# EAGLE design CDTV-adaptor-ATX_1.1 (EAGLE 7.7.0)
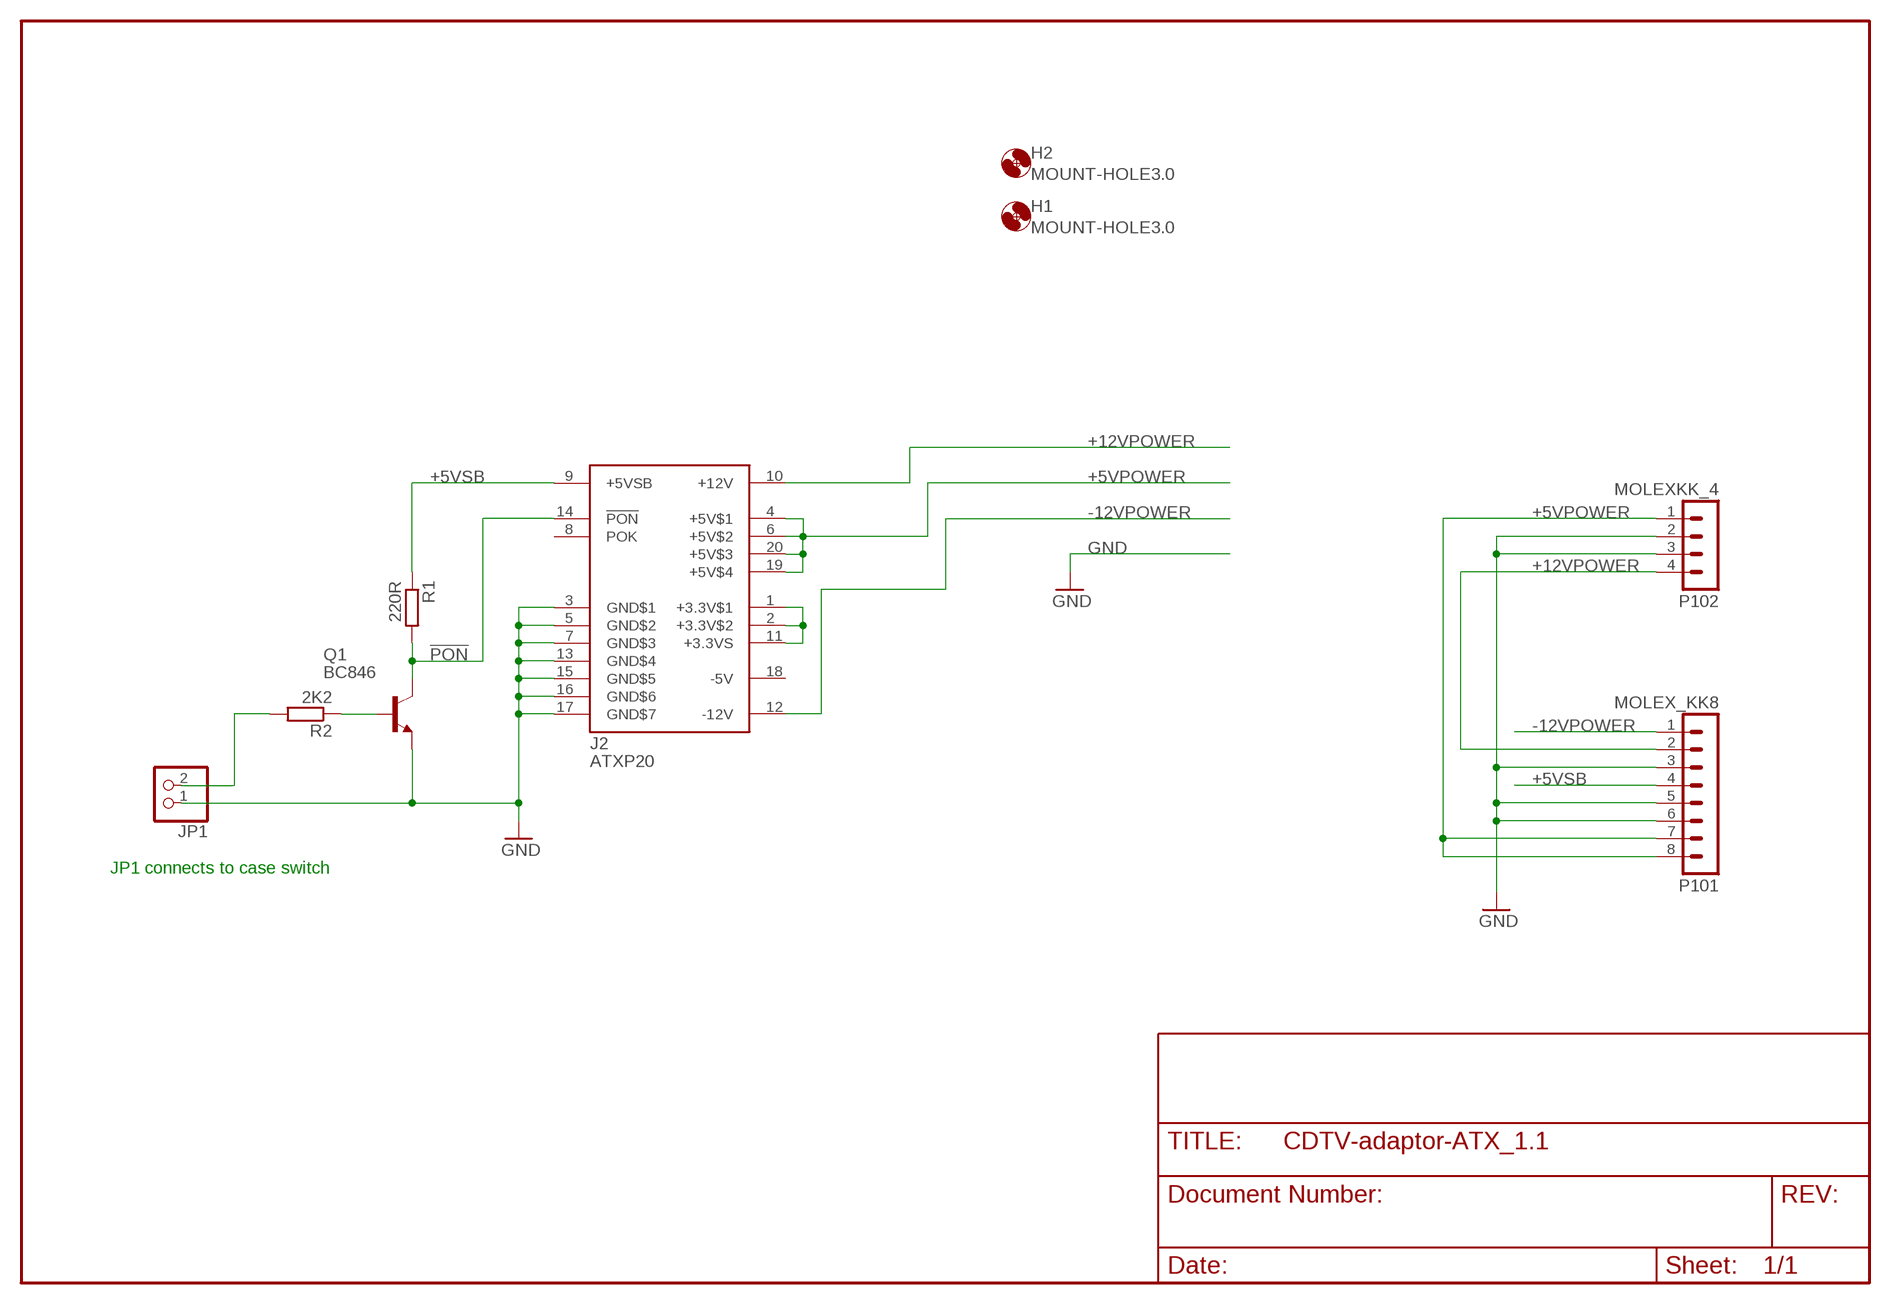
[diagram p0: schematic, sheet 1]

## Parts
H1  MOUNT-HOLE3.0  [3,0]
H2  MOUNT-HOLE3.0  [3,0]
J2  ATXP20  [MOLEX39281203]
JP1  PINHD-1X2  [1X02]
P101  MOLEX_KK8  [MOLEX_KK8]
P102  MOLEXKK_4  [MA04-1]
Q1  BC846  [SOT23]
R1  220R  R-EU_R0603  [R0603]
R2  2K2  R-EU_R0603  [R0603]

## Nets
!PON: J2.14(!PON) Q1.3(C) R1.2
+5VPOWER: J2.4(+5V$1) J2.6(+5V$2) J2.19(+5V$4) J2.20(+5V$3) P101.7 P101.8 P102.1
+5VSB: J2.9(+5VSB) P101.4 R1.1
+12VPOWER: J2.10(+12V) P101.2 P102.4
-12VPOWER: J2.12(-12V) P101.1
GND: J2.3(GND$1) J2.5(GND$2) J2.7(GND$3) J2.13(GND$4) J2.15(GND$5) J2.16(GND$6) J2.17(GND$7) JP1.1 P101.3 P101.5 P101.6 P102.2 P102.3 Q1.2(E)
N$3: Q1.1(B) R2.1
N$4: J2.1(+3.3V$1) J2.2(+3.3V$2) J2.11(+3.3VS)
SWITCH: JP1.2 R2.2
Unconnected: J2.8(POK)

## Notes on the sheet
- JP1 connects to case switch

## Power pins joined to a net without a drawn wire
-5V: J2.18(-5V)

## Library data of the parts
H1 H2 = holes:MOUNT-HOLE: MOUNTING HOLE with drill center marker
J2 = ads4:ATXP20: ATX 20-pin power connector
JP1 = pinhead:PINHD-1X2: PIN HEADER
P101 = IANS:MOLEX_KK8
P102 = IANS:MOLEXKK_4: Molex KK connector, 4 way, 2.54 mm pitch
Q1 = transistor:BC846: NPN TRANSISTOR
R1 R2 = rcl:R-EU_: RESISTOR, European symbol

## Board
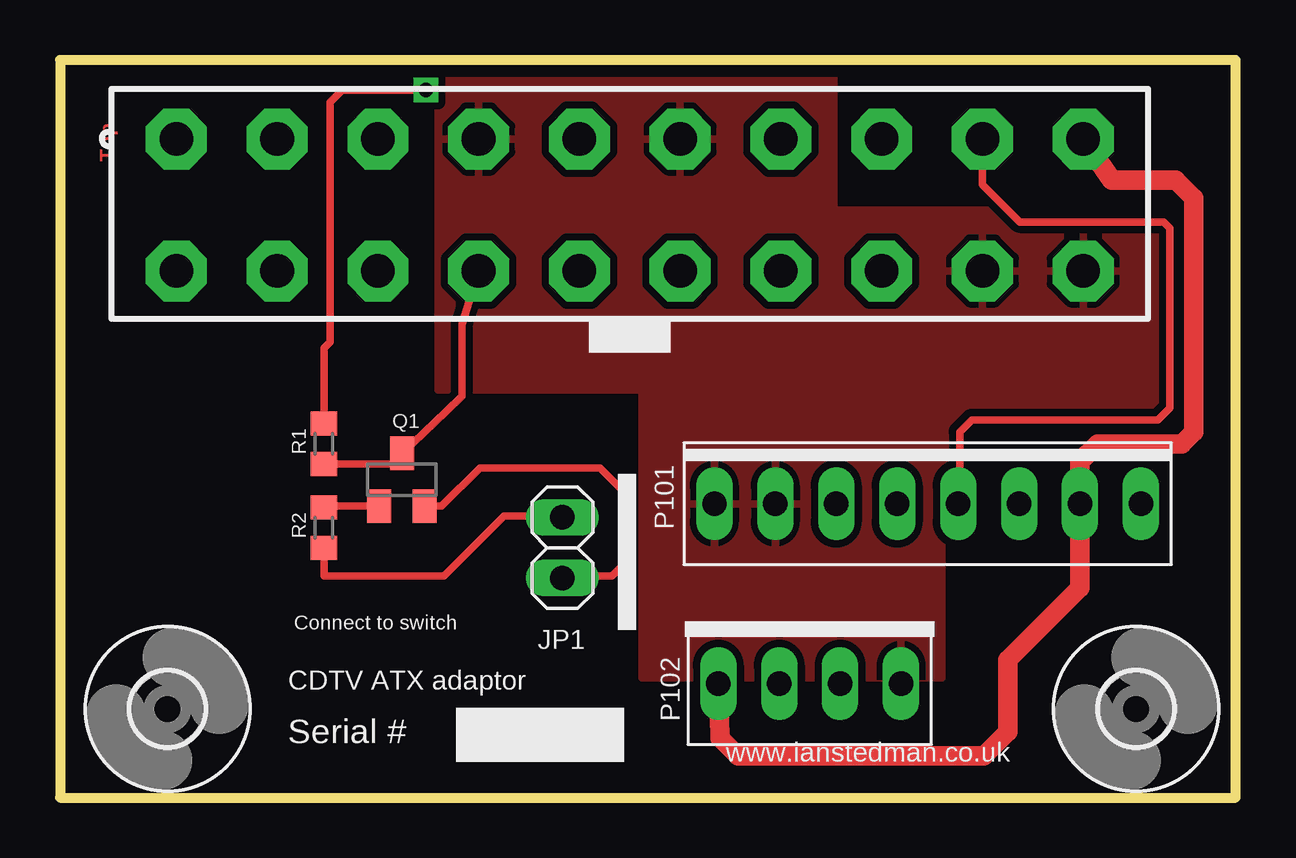
[diagram p1: board, top side]
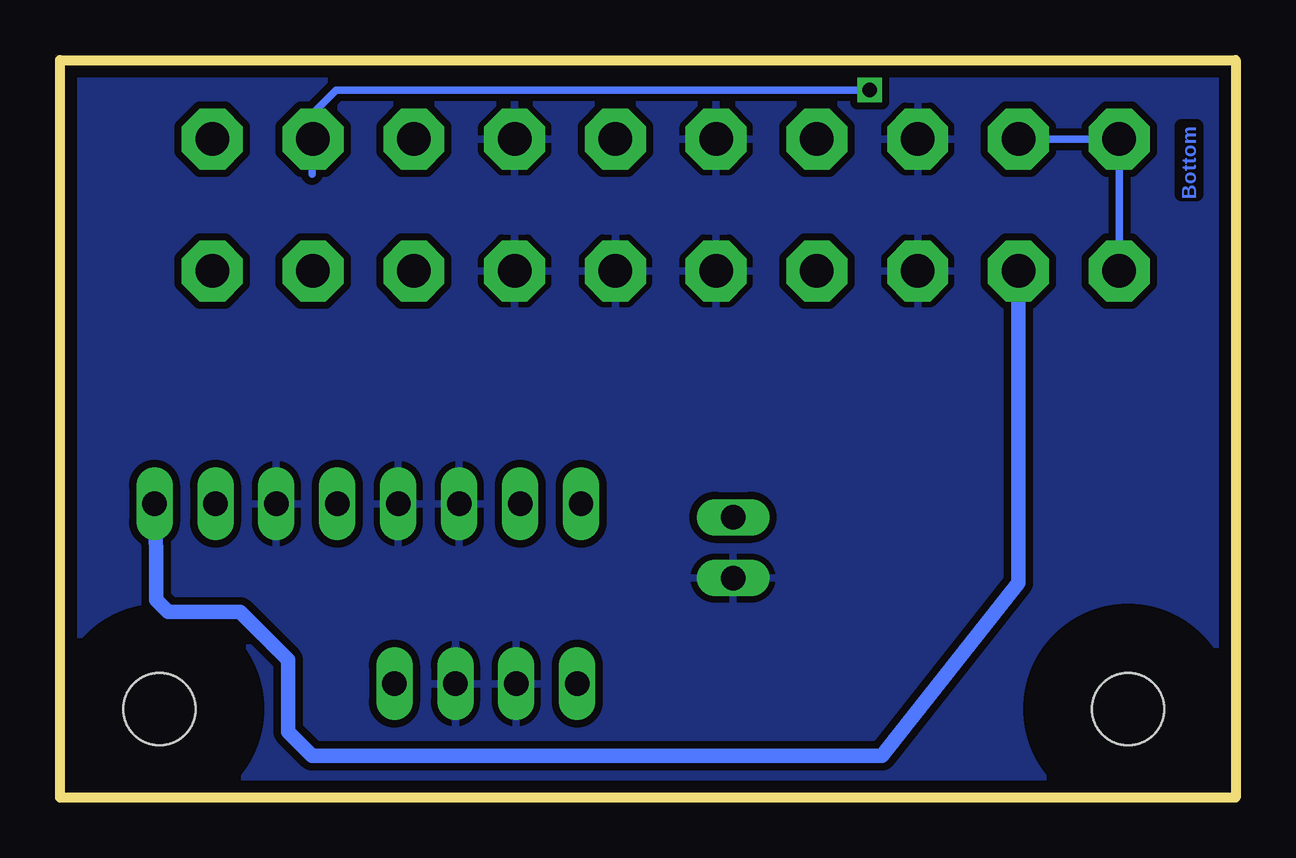
[diagram p2: board, bottom side, seen from below]

Size 49 x 30.75 mm. Coordinates in mm from the lower left corner, seen from the top.
Outline: 0,0 49,0 49,30.75 0,30.75 0,0
Copper layers (1*16): Top 0.035mm / dielectric 1.5mm / Bottom 0.035mm
Design rules "pcbtrainsmt": minimum track width 0.15mm, minimum drill 0.5mm, track to track 0.15mm, track to pad 0.15mm, pad to pad 0.15mm, via to via 0.15mm, smd to smd 0.15mm, copper to edge 0.5mm, drill to drill 0.5mm, minimum pad ring 5mil, minimum via ring 8mil, stop-mask expansion 0mil, vias tented up to drill 0mil, thermal gap 10mil

### Footprints (pad centres in the part's own frame; a part is rotated, then mirrored left to right if it is on the bottom)
3,0 = hole 3: 0,0
MOLEX39281203 = drill 1.4 pad 2.54 octagon: 1 -18.9,2.7; 2 -14.7,2.7; 3 -10.5,2.7; 4 -6.3,2.7; 5 -2.1,2.7; 6 2.1,2.7; 7 6.3,2.7; 8 10.5,2.7; 9 14.7,2.7; 10 18.9,2.7; 11 -18.9,-2.8; 12 -14.7,-2.8; 13 -10.5,-2.8; 14 -6.3,-2.8; 15 -2.1,-2.8; 16 2.1,-2.8; 17 6.3,-2.8; 18 10.5,-2.8; 19 14.7,-2.8; 20 18.9,-2.8
1X02 = drill 1.016 long: 1 -1.27,0; 2 1.27,0
MOLEX_KK8 = drill 1.016 long: 1 -3.81,0; 2 -1.27,0; 3 1.27,0; 4 3.81,0; 5 6.35,0; 6 8.89,0; 7 11.43,0; 8 13.97,0
MA04-1 = drill 1.016 long: 1 -3.81,0; 2 -1.27,0; 3 1.27,0; 4 3.81,0
SOT23 = smd 1 x 1.4: 1 -0.95,-1.1; 2 0.95,-1.1; 3 0,1.1
R0603 = smd 1 x 1.1: 1 -0.85,0; 2 0.85,0

### Placement (x,y rotation side)
H1  44.85,3.7 0 top
H2  4.49,3.7 0 top
J2  23.75,24.75 0 top
JP1  20.94,10.42 90 top
P101  41.25,12.25 180 top
P102  31.25,4.75 180 top
Q1  14.25,13.25 0 top
R1  11,14.75 270 top
R2  11,11.25 270 top

### Tracks (layer width: path | path; a pad name or v marks a point on that pad's centre or on a via)
!PON
  Top 0.305: J2.14 16.75,19.75 16.75,16.75 16.1,16.1 Q1.3 13.8,13.9 R1.2
+5VPOWER
  pour Top (isolate 0.305): 15.75,30.5 15.75,17 24.25,17 24.25,5 36.75,5 36.75,13.75 42.5,13.75 42.5,15 45.75,15 45.75,24.5 32.25,24.5 32.25,30.25 32,30.25
+5VSB  (via drill 0.6)
  Top 0.305: J2.9 38.45,25.55 40,24 46,24 46.25,23.75 46.25,16.25 45.75,15.75 38,15.75 37.5,15.25 37.5,12.31 P101.4 | R1.1 11,18.75 11.25,19 11.25,29 11.75,29.5 v15.25,29.5
  Bottom 0.305: v15.25,29.5 37.5,29.5 38.5,28.5 38.5,26 J2.9
+12VPOWER
  Top 0.813: J2.10 43.85,25.75 46.5,25.75 47.25,25 47.25,15.25 46.75,14.75 43.25,14.75 42.52,14.02 P101.2 42.5,10.23 42.5,8.75 39.5,5.75 39.5,2.75 38.5,1.75 28.25,1.75 27.5,2.5 27.44,5.06 P102.4
-12VPOWER
  Bottom 0.61: J2.12 9.05,8.95 14.75,1.75 38.5,1.75 39.5,2.75 39.5,5.75 41.5,7.75 44.5,7.75 45,8.25 45,10.19 P101.1
GND
  Top 0.305: Q1.2 15.9,12.15 17.5,13.75 22.5,13.75 23.5,12.75 23.5,9.75 23,9.25 21.04,9.25 JP1.1
  pour Bottom (isolate 0.305): 0.5,30.25 48.5,30.25 48.5,0.75 0.5,0.5
N$3
  Top 0.305: Q1.1 11.05,12.15 R2.1
N$4
  Bottom 0.305: J2.2 J2.1 J2.11
SWITCH
  Top 0.305: R2.2 11,9.25 16,9.25 18.5,11.75 20.88,11.75 JP1.2

### Text on the board
Top: Top
Bottom: Bottom
tPlace: Connect to switch | CDTV ATX adaptor | Serial # | www.ianstedman.co.uk